# Altium schematic sheet Communication.SchDoc
size A; SheetNumber: 1; SheetTotal: 1
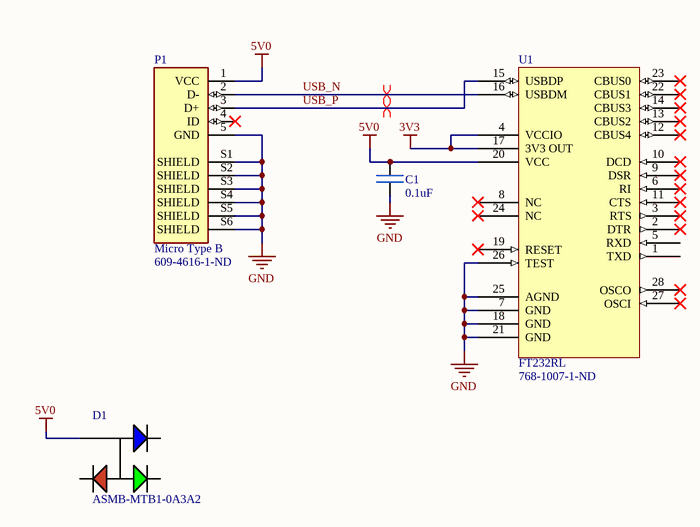
[diagram p0: Communication.SchDoc]

## Parts
C1  0.1uF  [CAP0.1uF]
D1  Manufacturer Part Number 1: ASMB-MTB1-0A3A2  [LED_RGB]  (hidden comment: LED_RGB_Neopixel)
P1  Micro Type B  Supplier Part Number 1: 609-4616-1-ND  [FCI_10118193-0001LF]
U1  FT232RL  Supplier Part Number 1: 768-1007-1-ND  [FT232RL]

## Nets
3V3: U1.4(VCCIO) U1.17(3V3_OUT)
5V0: C1.1 D1.4(COMMON_ANODE) P1.1(VCC) U1.20(VCC)
GND: C1.2 P1.5(GND) P1.S1(SHIELD) P1.S2(SHIELD) P1.S3(SHIELD) P1.S4(SHIELD) P1.S5(SHIELD) P1.S6(SHIELD) U1.7(GND) U1.18(GND) U1.21(GND) U1.25(AGND) U1.26(TEST)
USB_N: P1.2(D-) U1.16(USBDM)
USB_P: P1.3(D+) U1.15(USBDP)

Not connected (* = marked no-connect by the designer): D1 1(CATHODE_(RED)) 2(CATHODE_(GREEN)) 3(CATHODE_(BLUE)); P1 4(ID)*; U1 1(TXD) 2(DTR)* 3(RTS)* 5(RXD) 6(RI)* 8(NC)* 9(DSR)* 10(DCD)* 11(CTS)* 12(CBUS4)* 13(CBUS2)* 14(CBUS3)* 19(RESET)* 22(CBUS1)* 23(CBUS0)* 24(NC)* 27(OSCI)* 28(OSCO)*

## Layout directives
differential pair: USB_N, USB_P

## Library data of the parts
C1 = CAP 0.1uF: Ceramic Capacitor, Multilayer, Ceramic, 16V, 10% +Tol, 10% -Tol, X7R, 15% TC, 0.1uF, Surface Mount, 0402; Manufacturer: Murata; Manufacturer Part Number: GRM155R71C104KA88D; Capacitance: 100nF; Multilayer: Yes; Supplier 1: Digi-Key; RoHS: Yes; Category: Ceramic Capacitors; Stock 1: 19996896; Pricing 1: 1=0.10000, 10=0.02100, 50=0.01140, 100=0.00930, 500=0.00666, 1000=0.00523, 2500=0.00476, 5000=0.00438 (USD); Mount: Surface Mount; Number of Pins: 2; Dielectric Material: Ceramic; Size Code: 0402; Terminal Finish: Nickel; Package Shape: Rectangular; Min Operating Temperature: -55°C; Max Operating Temperature: 125°C; JESD-609 Code: e3; Capacitor Type: Ceramic; Negative Tolerance: 10%; Packaging: Tape and Reel; Positive Tolerance: 10%; Rated DC Voltage (URdc): 16V; Temperature Characteristics Code: X7R; Termination: Wraparound; Package Style: SMTMeter; Length: 1mm; Width: 0.5mm; ComponentLink1URL: https://psearch.en.murata.com:443/capacitor/product/GRM155R71C104KA88%23.pdf?src-supplier=IHS+Markit; ComponentLink1Description: https://psearch.en.murata.com:443/capacitor/product/GRM155R71C104KA88%23.pdf?src-supplier=IHS+Markit; ComponentLink2URL: https://datasheet.ciiva.com/129/grm155r71c104ka88-01-129740.pdf?src-supplier=Digi-Key; ComponentLink2Description: https://datasheet.ciiva.com/129/grm155r71c104ka88-01-129740.pdf?src-supplier=Digi-Key; ComponentLink3URL: https://datasheet.ciiva.com/18102/getdatasheetpartid-85307-18102905.pdf?src-supplier=Verical; ComponentLink3Description: https://datasheet.ciiva.com/18102/getdatasheetpartid-85307-18102905.pdf?src-supplier=Verical; ComponentLink4URL: https://datasheet.ciiva.com/129/grm155r71c104ka88-01-129739.pdf?src-supplier=Digi-Key; ComponentLink4Description: https://datasheet.ciiva.com/129/grm155r71c104ka88-01-129739.pdf?src-supplier=Digi-Key; ComponentLink5URL: https://datasheet.ciiva.com/29199/454098-da-01-en-vs-kondensator-0402-29199799.pdf?src-supplier=Conrad; ComponentLink5Description: https://datasheet.ciiva.com/29199/454098-da-01-en-vs-kondensator-0402-29199799.pdf?src-supplier=Conrad; ComponentLink6URL: https://datasheet.ciiva.com/28534/4360-28534133.pdf?src-supplier=Element14; ComponentLink6Description: https://datasheet.ciiva.com/28534/4360-28534133.pdf?src-supplier=Element14; ComponentLink7URL: https://datasheet.ciiva.com/14103/grmseries-highdielectrictype-eng-14103750.pdf?src-supplier=Distrelec; ComponentLink7Description: https://datasheet.ciiva.com/14103/grmseries-highdielectrictype-eng-14103750.pdf?src-supplier=Distrelec; ComponentLink8URL: https://datasheet.ciiva.com/16199/product-16199000.pdf?src-supplier=Future+Electronics; ComponentLink8Description: https://datasheet.ciiva.com/16199/product-16199000.pdf?src-supplier=Future+Electronics; ComponentLink9URL: https://datasheet.ciiva.com/14116/grmseries-highdielectrictype-eng-14116878.pdf?src-supplier=Distrelec; ComponentLink9Description: https://datasheet.ciiva.com/14116/grmseries-highdielectrictype-eng-14116878.pdf?src-supplier=Distrelec; ComponentLink10URL: https://datasheet.ciiva.com/7937/4360-7937615.pdf?src-supplier=Element14; ComponentLink10Description: https://datasheet.ciiva.com/7937/4360-7937615.pdf?src-supplier=Element14; ComponentLink11URL: https://datasheet.ciiva.com/28534/4360-28534127.pdf?src-supplier=Element14; ComponentLink11Description: https://datasheet.ciiva.com/28534/4360-28534127.pdf?src-supplier=Element14; Height: 0.5mm; Supplier Part Number 1: 490-3261-1-ND
D1 = LED_RGB_Neopixel: LED RGB DIFFUSED 4PLCC SMD; Manufacturer 1: Broadcom; Color: Blue,Green,Red; Lens Color: White; Viewing Angle: 115°; Lens Style: Round; Luminous Intensity: 350mcd; Dominant Wavelength: 470nm; Forward Voltage: 3.1V; Test Current: 20mA; Package/Footprint: 4-PLCC; Supplier 1: Digi-Key; Mounting Type: SMD; Number of Pins: 4; Lens Transparency: Diffused; Supplier Part Number 1: 516-3280-1-ND
P1 = USB Connector: USB Connector, 5 Contact(s), Female, Right Angle, Solder Terminal, Locking, Receptacle; Manufacturer: Amphenol FCI; Manufacturer Part Number: 10118193-0001LF; Manufacturer Series: 10118193; Contact Resistance: 30mR; Durability: 10000Cycles; Empty Shell: No; Insertion Force-Max: 35.1392N; Insulation Resistance: 1GR; Mating Information: MULTIPLE MATING PARTS AVAILABLE; Number Of Connectors: 1; PCB Contact Pattern: RECTANGULAR; Polarization Key: POLAR PIN POSITION; Rated Current (Signal): 1.8A; Number of Contacts: 5; Connector Type: TELECOM AND DATACOM CONNECTOR; Option: General Purpose; Board Mounting Option: LOCATING POSTS; Plating Thickness: 30uin; Body Breadth: 0.122inch; Body Depth: 0.199inch; Body Length: 0.309inch; Reference Standard: UL; Reliability: COMMERCIAL; Supplier 1: Digi-Key; RoHS: Yes; Category: USB Connectors; Stock 1: 43659; Pricing 1: 1=0.45000, 10=0.43000, 25=0.36840, 50=0.31320, 100=0.30090, 250=0.27016, 500=0.25788 (USD); ComponentLink1URL: https://datasheet.ciiva.com:443/pdfs/VipMasterIC/IC/FRCI/FRCI-S-A0000088532/FRCI-S-A0001133856-1.pdf?src-supplier=IHS+Markit; ComponentLink1Description: https://datasheet.ciiva.com:443/pdfs/VipMasterIC/IC/FRCI/FRCI-S-A0000088532/FRCI-S-A0001133856-1.pdf?src-supplier=IHS+Markit; Mount: Board; Insulation Material: Polymer; Shell Finish: Tin; Shell Material: Stainless Steel; Contact Material: Copper Alloy; Contact Finish - Mating: GOLD (30) OVER NICKEL; Contact Finish - Termination: GOLD FLASH OVER NICKEL; Contact Gender: Female; Contact Style: USB; Filter Feature: No; Mixed Contacts: No; Mounting Style: RIGHT ANGLE; Number Of PCB Rows: 1; Termination: Solder; JESD-609 Code: e4; Body/Shell Style: RECEPTACLE; Mounting Option 1: LOCKING; Terminal Pitch: 0.6604mm; Flammability Rating: UL94 V-0; DIN Conformance: No; IEC Conformance: No; MIL Conformance: No; ComponentLink2URL: https://datasheet.ciiva.com/851/10118193-851106.pdf?src-supplier=Digi-Key; ComponentLink2Description: https://datasheet.ciiva.com/851/10118193-851106.pdf?src-supplier=Digi-Key; ComponentLink3URL: https://datasheet.ciiva.com/26853/getdatasheetpartid-418618-26853893.pdf?src-supplier=Verical; ComponentLink3Description: https://datasheet.ciiva.com/26853/getdatasheetpartid-418618-26853893.pdf?src-supplier=Verical; ComponentLink4URL: https://datasheet.ciiva.com/4598/10118193ac-197151-4598799.pdf?src-supplier=Mouser; ComponentLink4Description: https://datasheet.ciiva.com/4598/10118193ac-197151-4598799.pdf?src-supplier=Mouser; ComponentLink5URL: https://datasheet.ciiva.com/14802/10118193-0001lf-webpage-14802386.pdf?src-supplier=Arrow+Electronics; ComponentLink5Description: https://datasheet.ciiva.com/14802/10118193-0001lf-webpage-14802386.pdf?src-supplier=Arrow+Electronics; ComponentLink6URL: https://datasheet.ciiva.com/851/10118193-851107.pdf?src-supplier=Digi-Key; ComponentLink6Description: https://datasheet.ciiva.com/851/10118193-851107.pdf?src-supplier=Digi-Key; ComponentLink7URL: https://datasheet.ciiva.com/851/10118193-851108.pdf?src-supplier=Digi-Key; ComponentLink7Description: https://datasheet.ciiva.com/851/10118193-851108.pdf?src-supplier=Digi-Key; ComponentLink8URL: https://datasheet.ciiva.com/14618/70236827-14618887.pdf?src-supplier=Allied+Electronics; ComponentLink8Description: https://datasheet.ciiva.com/14618/70236827-14618887.pdf?src-supplier=Allied+Electronics
U1 = FT232RL: USB Bus Controller, CMOS, PDSO28; Manufacturer: FTDI; Manufacturer Part Number: FT232RL-REEL; Package Body Material: Plastic; Max Frequency: 48MHz; Max Supply Current: 100uA; Max Supply Voltage: 5.25V; Min Supply Voltage: 3.3V; Qualification Status: Not Qualified; Supplier 1: Digi-Key; RoHS: Yes; Category: Interface ICs; Stock 1: 118964; Pricing 1: 1=4.50000, 10=4.05000, 50=3.85000, 100=3.65000, 250=3.25000, 500=2.85002, 1000=2.65000 (USD); Package Code: SSOP; Number of Pins: 28; Package Shape: Rectangular; Min Operating Temperature: -40°C; Max Operating Temperature: 85°C; JESD-30 Code: R-PDSO-G28; Moisture Sensitivity Level: 3; Package Style: SMALL OUTLINE, SHRINK PITCHMeter; Surface Mount: Yes; Technology: CMOS; Terminal Form: Gull Wing; Terminal Position: DUAL; Length: 10.2mm; Width: 5.3mm; Height - Seated (Max): 2mm; Terminal Pitch: 0.65mm; Temperature Grade: INDUSTRIAL; ComponentLink1URL: https://datasheet.ciiva.com:443/pdfs/VipMasterIC/IC/FTDI/FTDI-S-A0007980421/FTDI-S-A0007980421-1.pdf?src-supplier=IHS+Markit; ComponentLink1Description: https://datasheet.ciiva.com:443/pdfs/VipMasterIC/IC/FTDI/FTDI-S-A0007980421/FTDI-S-A0007980421-1.pdf?src-supplier=IHS+Markit; ComponentLink2URL: https://datasheet.ciiva.com/34304/2161019-34304054.pdf?src-supplier=Jameco; ComponentLink2Description: https://datasheet.ciiva.com/34304/2161019-34304054.pdf?src-supplier=Jameco; ComponentLink3URL: https://datasheet.ciiva.com/4787/ds-ft232r-11534-4787658.pdf?src-supplier=Mouser; ComponentLink3Description: https://datasheet.ciiva.com/4787/ds-ft232r-11534-4787658.pdf?src-supplier=Mouser; ComponentLink4URL: https://datasheet.ciiva.com/26841/ft232rl-reel-26841080.pdf?src-supplier=IIIC; ComponentLink4Description: https://datasheet.ciiva.com/26841/ft232rl-reel-26841080.pdf?src-supplier=IIIC; ComponentLink5URL: https://datasheet.ciiva.com/1787/ds-ft232r-1787047.pdf?src-supplier=Digi-Key; ComponentLink5Description: https://datasheet.ciiva.com/1787/ds-ft232r-1787047.pdf?src-supplier=Digi-Key; ComponentLink6URL: https://datasheet.ciiva.com/1787/ds-ft232r-1787048.pdf?src-supplier=Digi-Key; ComponentLink6Description: https://datasheet.ciiva.com/1787/ds-ft232r-1787048.pdf?src-supplier=Digi-Key; ComponentLink7URL: https://datasheet.ciiva.com/1787/ds-ft232r-1787049.pdf?src-supplier=Digi-Key; ComponentLink7Description: https://datasheet.ciiva.com/1787/ds-ft232r-1787049.pdf?src-supplier=Digi-Key; ComponentLink8URL: https://datasheet.ciiva.com/15150/getdatasheetpartid-643207-15150506.pdf?src-supplier=Verical; ComponentLink8Description: https://datasheet.ciiva.com/15150/getdatasheetpartid-643207-15150506.pdf?src-supplier=Verical; ComponentLink9URL: https://datasheet.ciiva.com/16200/ds-ft232r-16200652.pdf?src-supplier=Future+Electronics; ComponentLink9Description: https://datasheet.ciiva.com/16200/ds-ft232r-16200652.pdf?src-supplier=Future+Electronics